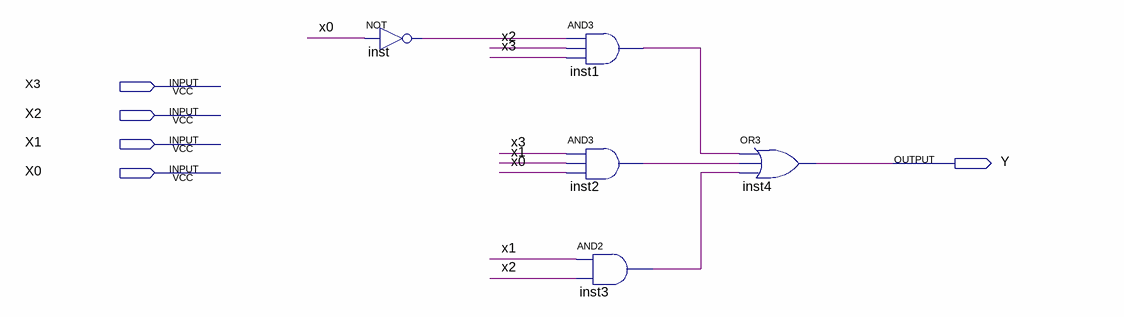
[diagram p0: schematic sheet]
// Quartus schematic Lab1Test.bdf as structural Verilog: 5 symbols, 5 pins
module Lab1Test (
  input  X3,
  input  X2,
  input  X1,
  input  X0,
  output Y
);

  wire inst1_out, inst2_out, inst3_out, inst_out;

  not inst (inst_out, X0);
  and inst1 (inst1_out, inst_out, X2, X3);
  and inst2 (inst2_out, X3, X1, X0);
  and inst3 (inst3_out, X1, X2);
  or inst4 (Y, inst1_out, inst2_out, inst3_out);
endmodule
